# Altium schematic sheet Color_Sensor.SchDoc
size A; SheetNumber: 2; SheetTotal: 3
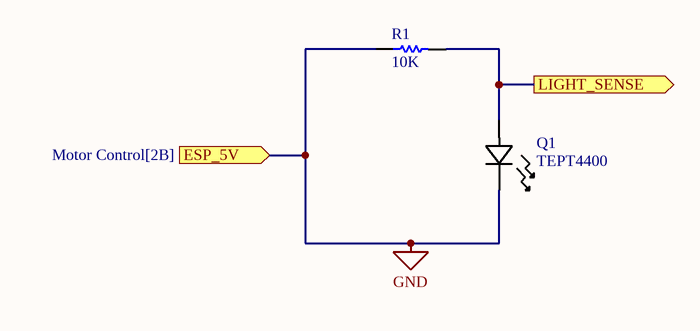
[diagram p0: Color_Sensor.SchDoc]

## Parts
Q1  TEPT4400  [LED_TEPT4400_VIS]
R1  value 10K  (hidden comment: Resistor)

## Ports
ESP_5V (in, see Motor Control[2B]), LIGHT_SENSE (out)

## Nets
GND: Q1.1 R1.1 ; port ESP_5V
LIGHT_SENSE: Q1.2 R1.2 ; port LIGHT_SENSE

## Library data of the parts
Q1 = TEPT4400: PHOTO TRANS. 3MM  30DEG-e4; Manufacturer_Name: Vishay; Copyright: Copyright (C) 2026 Ultra Librarian. All rights reserved.; Manufacturer_Part_Number: TEPT4400; Datasheet: https://www.vishay.com/doc?81341
R1 = Resistor: TC1: 0; SimulationGenericComponent: True; TC2: 0